# Altium schematic sheet WX0.012.461DL.SchDoc
size A2
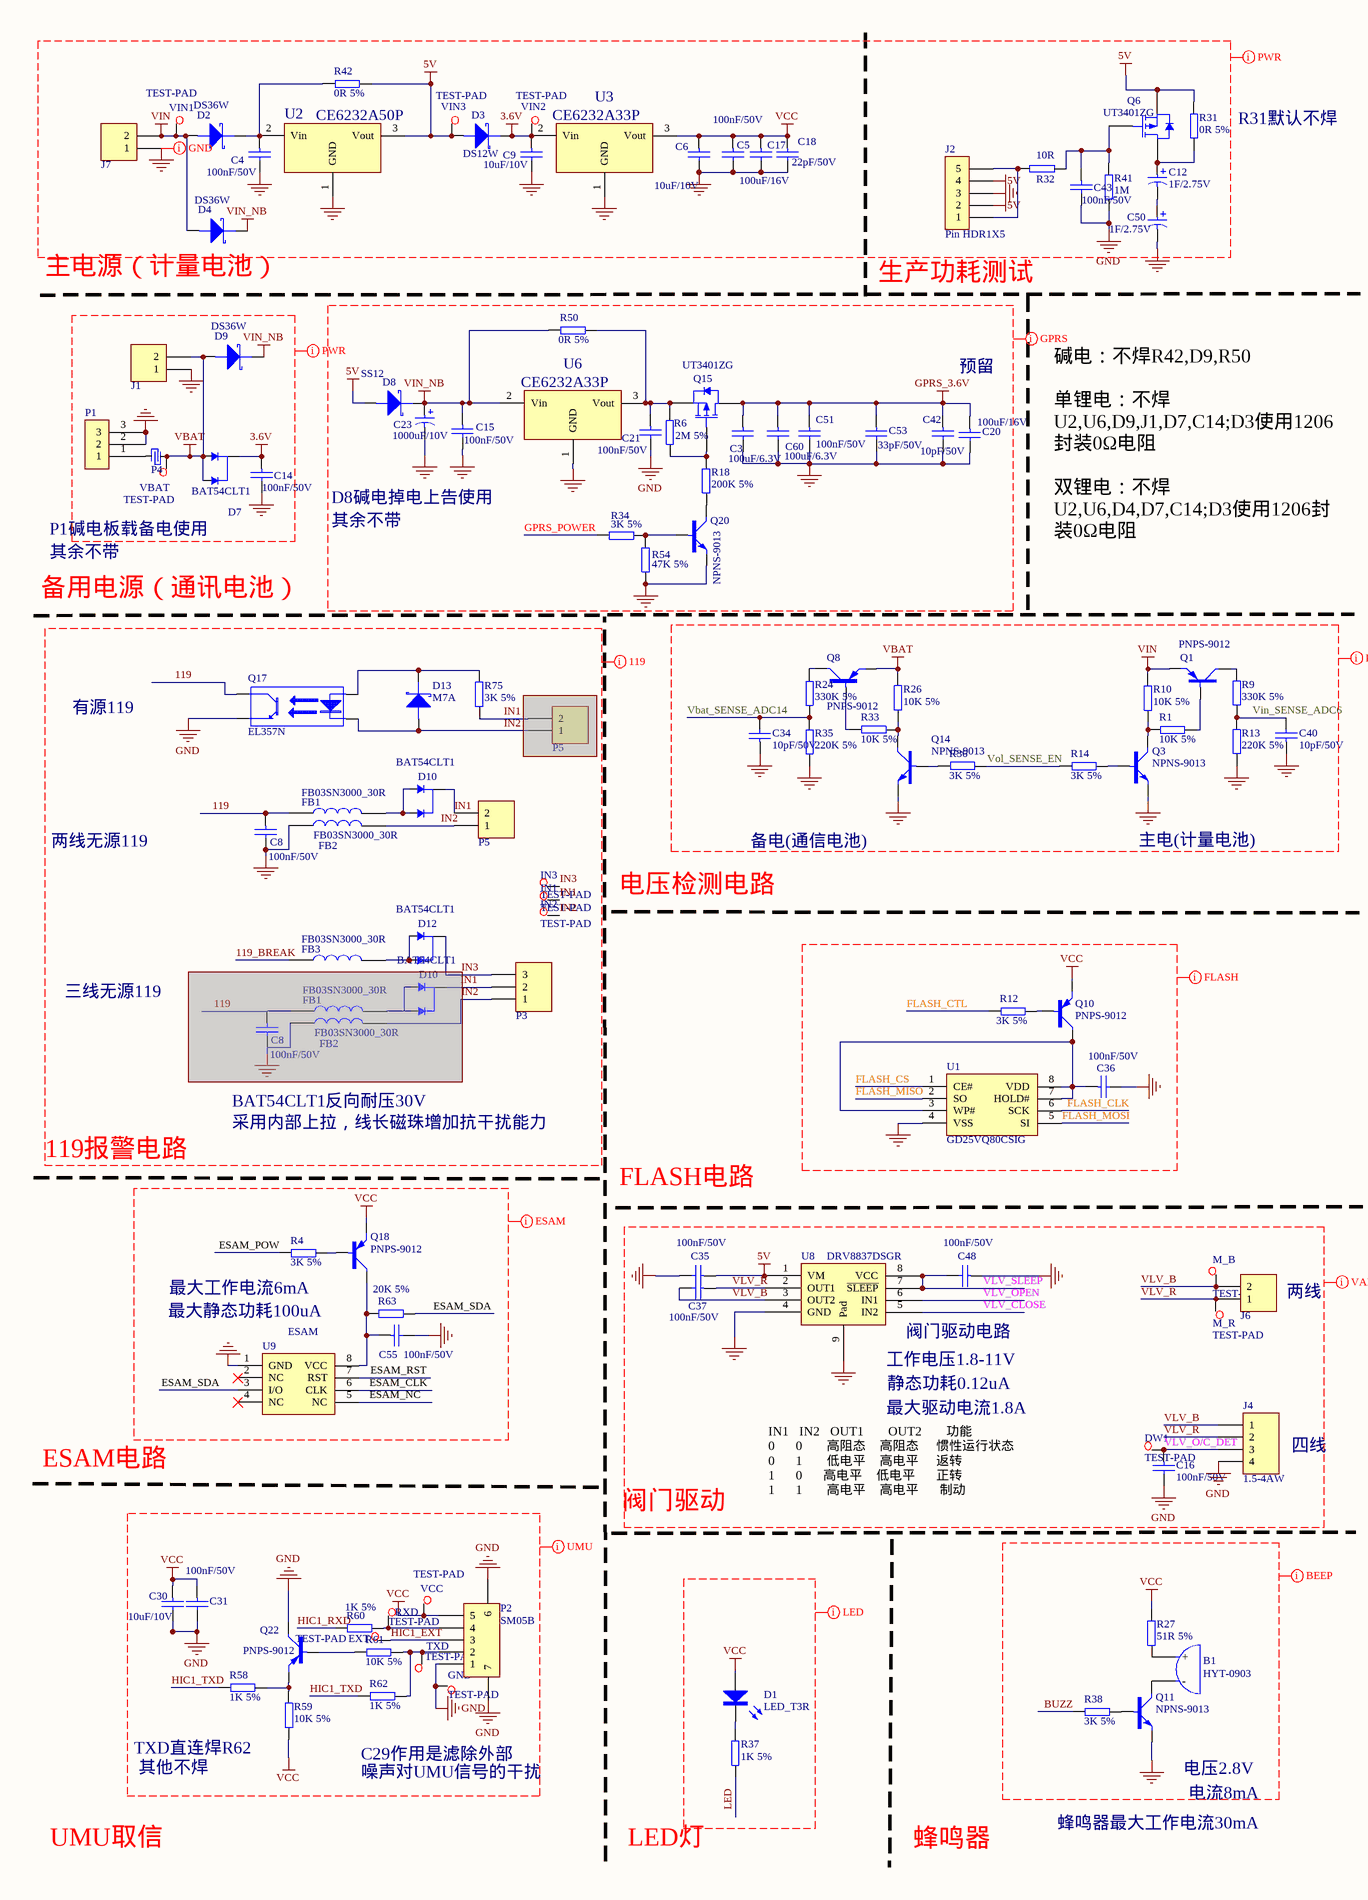
[diagram p0: WX0.012.461DL.SchDoc, left]
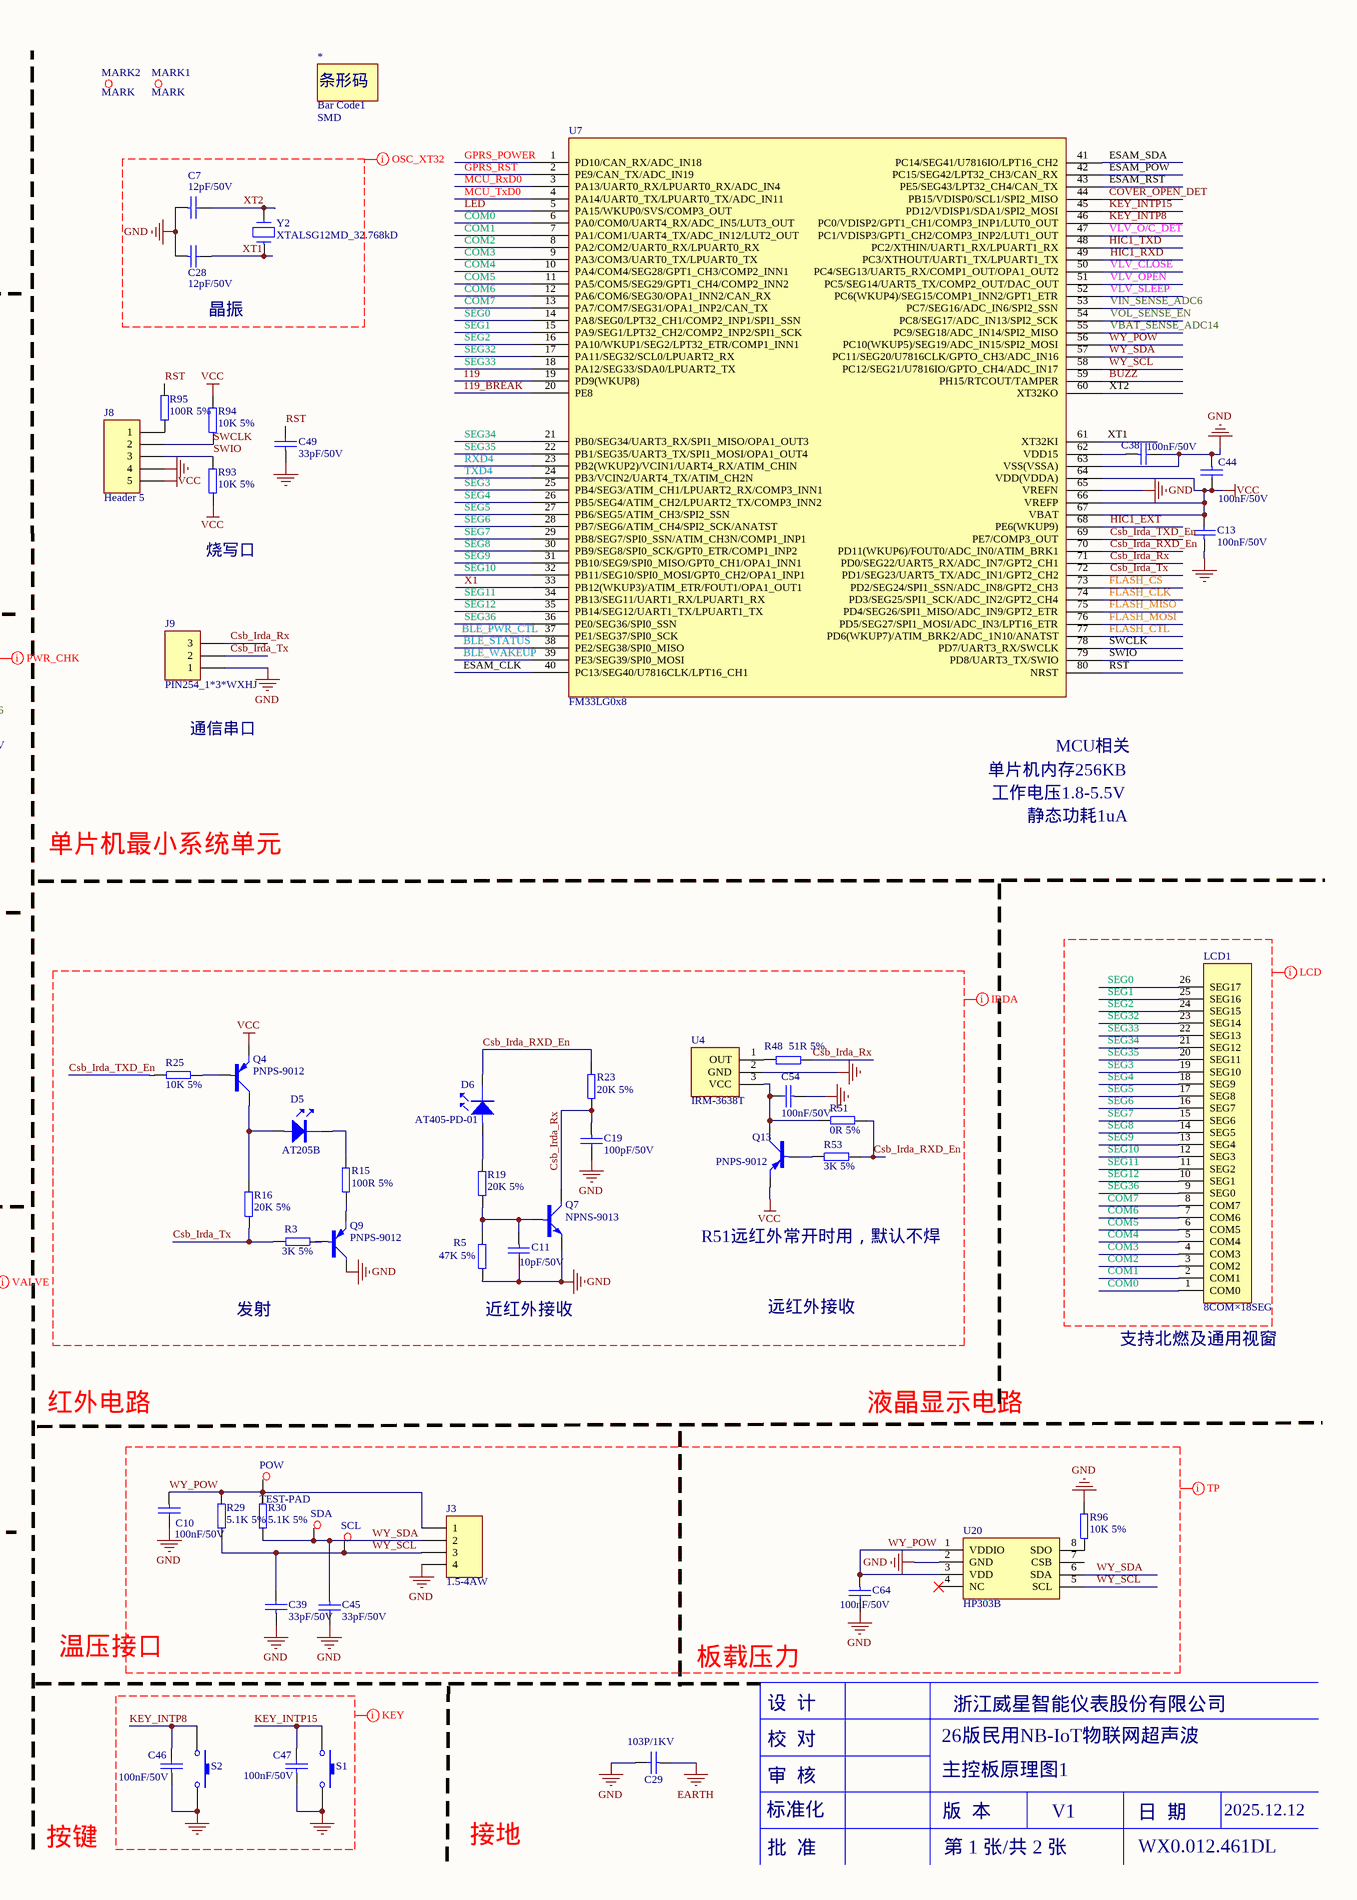
[diagram p1: WX0.012.461DL.SchDoc, right]

## Parts
(Parts that share a designator on the sheet are numbered #1, #2 ... from top to bottom, then left to right.)
*  Bar Code1  SMD/DIP: SMD  [Bar Code1]
B1  HYT-0903  [HYT-0903]
C3  100uF/6.3V  [GRM1206]
C4  100nF/50V  [CAP0402]
C5  100nF/50V  [CAP0402]
C6  10uF/10V  [CAP0402]
C7  12pF/50V  [CAP0402]
C8#1  100nF/50V  [CAP0402]
C8#2  100nF/50V  [CAP0402]  (masked out: inside a compile mask, not in the netlist)
C9  10uF/10V  [CAP0402]
C10  100nF/50V  [CAP0402]
C11  10pF/50V  [CAP0402]
C12  1F/2.75V  [CAPPC_350_800_1400]
C13  100nF/50V  [CAP0402]
C14  100nF/50V  [CAP0402]
C15  100nF/50V  [CAP0402]
C16  100nF/50V  [CAP0402]
C17  100uF/16V  [GRM31CR60J107ME39L]
C18  22pF/50V  [CAP0402]
C19  100pF/50V  [CAP0402]
C20  100uF/16V  [GRM31CR60J107ME39L]
C21  100nF/50V  [CAP0402]
C23  1000uF/10V  [CAPPC_350_800_1200]
C28  12pF/50V  [CAP0402]
C29  103P/1KV  [CAP1206]
C30  10uF/10V  [CAP0402]
C31  100nF/50V  [CAP0402]
C34  10pF/50V  [CAP0402]
C35  100nF/50V  [CAP0402]
C36  100nF/50V  [CAP0402]
C37  100nF/50V  [CAP0402]
C38  100nF/50V  [CAP0402]
C39  33pF/50V  [CAP0402]
C40  10pF/50V  [CAP0402]
C42  10pF/50V  [CAP0402]
C43  100nF/50V  [CAP0402]
C44  100nF/50V  [CAP0402]
C45  33pF/50V  [CAP0402]
C46  100nF/50V  [CAP0402]
C47  100nF/50V  [CAP0402]
C48  100nF/50V  [CAP0402]
C49  33pF/50V  [CAP0402]
C50  1F/2.75V  [CAPPC_350_800_1400]
C51  100nF/50V  [CAP0402]
C53  33pF/50V  [CAP0402]
C54  100nF/50V  [CAP0402]
C55  100nF/50V  [CAP0402]
C60  100uF/6.3V  [GRM1206]
C64  100nF/50V  [CAP0402]
D1  LED_T3R  [IR_254_1000_500]
D2  DS36W  [SOD-123FL]
D3  DS12W  [SOD-123FL]
D4  DS36W  [SOD-123FL]
D5  AT205B  [IR_254_1000_500]
D6  AT405-PD-01  [IR_254_1000_500]
D7  BAT54CLT1  [SOT-23]
D8  SS12  [DO-214AC]
D9  DS36W  [SOD-123FL]
D10#1  BAT54CLT1  [SOT-23]
D10#2  BAT54CLT1  [SOT-23]  (masked out: inside a compile mask, not in the netlist)
D12  BAT54CLT1  [SOT-23]
D13  M7A  [DO-214AC]
DW1  TEST-PAD  [TEST-PAD]
EXT  TEST-PAD  [TEST-PAD]
FB1#1  FB03SN3000_30R  [IND0603]
FB1#2  FB03SN3000_30R  [IND0603]  (masked out: inside a compile mask, not in the netlist)
FB2#1  FB03SN3000_30R  [IND0603]
FB2#2  FB03SN3000_30R  [IND0603]  (masked out: inside a compile mask, not in the netlist)
FB3  FB03SN3000_30R  [IND0603]
GND  TEST-PAD  [TEST-PAD]
IN1  TEST-PAD  [TEST-PAD]
IN2  TEST-PAD  [TEST-PAD]
IN3  TEST-PAD  [TEST-PAD]
J1  PH200_1*2R  [PH200_1*2R]  (value not drawn)
J2  Pin HDR1X5  [PIN254_1*5SR]
J3  1.5-4AW  [1.5-4AW]
J4  1.5-4AW  [CONN-TH_530480410]
J6  PH200_1*2R  [PH200_1*2R]  (value not drawn)
J7  PH200_1*2R  [PH200_1*2R]  (value not drawn)
J8  Header 5  [PIN254_1*5SR]
J9  PIN254_1*3*WXHJ  [PIN254_1*3*WXHJ]
LCD1  8COM×18SEG  [LCD]
M_B  TEST-PAD  [TEST-PAD]
M_R  TEST-PAD  [TEST-PAD]
MARK1  MARK  [MARK]
MARK2  MARK  [MARK]
P1  Component_2  [板载锂电池]  (value not drawn)
P2  SM05B  [SMT-1.25-5]
P3  PH200_1*3R  [PH200_1*3R]  (value not drawn)
P4  Shortcircuit_Pad  [短路点]  (value not drawn)
P5#1  PH200_1*2R  [PH200_1*2R]  (value not drawn)  (masked out: inside a compile mask, not in the netlist)
P5#2  PH200_1*2R  [PH200_1*2R]  (value not drawn)
POW  TEST-PAD  [TEST-PAD]
Q1  PNPS-9012  [SOT-323-3_L2.0-W1.3-P1.30-LS2.1-BR]
Q3  NPNS-9013  [SOT-323-3_L2.0-W1.3-P1.30-LS2.1-BR]
Q4  PNPS-9012  [SOT-323-3_L2.0-W1.3-P1.30-LS2.1-BR]
Q6  UT3401ZG  [SOT-23]
Q7  NPNS-9013  [SOT-323-3_L2.0-W1.3-P1.30-LS2.1-BR]
Q8  PNPS-9012  [SOT-323-3_L2.0-W1.3-P1.30-LS2.1-BR]
Q9  PNPS-9012  [SOT-323-3_L2.0-W1.3-P1.30-LS2.1-BR]
Q10  PNPS-9012  [SOT-323-3_L2.0-W1.3-P1.30-LS2.1-BR]
Q11  NPNS-9013  [SOT-323-3_L2.0-W1.3-P1.30-LS2.1-BR]
Q13  PNPS-9012  [SOT-323-3_L2.0-W1.3-P1.30-LS2.1-BR]
Q14  NPNS-9013  [SOT-323-3_L2.0-W1.3-P1.30-LS2.1-BR]
Q15  UT3401ZG  [SOT-23]
Q17  EL357N  [EL357D]
Q18  PNPS-9012  [SOT-323-3_L2.0-W1.3-P1.30-LS2.1-BR]
Q20  NPNS-9013  [SOT-323-3_L2.0-W1.3-P1.30-LS2.1-BR]
Q22  PNPS-9012  [SOT-323-3_L2.0-W1.3-P1.30-LS2.1-BR]
R1  10K 5%  [RES0402]
R3  3K 5%  [RES0402]
R4  3K 5%  [RES0402]
R5  47K 5%  [RES0402]
R6  2M 5%  [RES0402]
R9  330K 5%  [RES0402]
R10  10K 5%  [RES0402]
R12  3K 5%  [RES0402]
R13  220K 5%  [RES0402]
R14  3K 5%  [RES0402]
R15  100R 5%  [RES0402]
R16  20K 5%  [RES0402]
R18  200K 5%  [RES0402]
R19  20K 5%  [RES0402]
R23  20K 5%  [RES0402]
R24  330K 5%  [RES0402]
R25  10K 5%  [RES0402]
R26  10K 5%  [RES0402]
R27  51R 5%  [RES0402]
R29  5.1K 5%  [RES0402]
R30  5.1K 5%  [RES0402]
R31  0R 5%  [RES1206]
R32  10R  [RES0402]
R33  10K 5%  [RES0402]
R34  3K 5%  [RES0402]
R35  220K 5%  [RES0402]
R36  3K 5%  [RES0402]
R37  1K 5%  [RES0402]
R38  3K 5%  [RES0402]
R41  1M  [RES0402]
R42  0R 5%  [RES1206]
R48  51R 5%  [RES0402]
R50  0R 5%  [RES1206]
R51  0R 5%  [RES0402]
R53  3K 5%  [RES0402]
R54  47K 5%  [RES0402]
R58  1K 5%  [RES0402]
R59  10K 5%  [RES0402]
R60  1K 5%  [RES0402]
R61  10K 5%  [RES0402]
R62  1K 5%  [RES0402]
R63  20K 5%  [RES0402]
R75  3K 5%  [RES0402]
R93  10K 5%  [RES0402]
R94  10K 5%  [RES0402]
R95  100R 5%  [RES0402]
R96  10K 5%  [RES0402]
RXD  TEST-PAD  [TEST-PAD]
S1  SWT_4_600_600_430  [SWT_4_600_600]  (value not drawn)
S2  SWT_4_600_600_430  [SWT_4_600_600]  (value not drawn)
SCL  TEST-PAD  [TEST-PAD]  (value not drawn)
SDA  TEST-PAD  [TEST-PAD]  (value not drawn)
TXD  TEST-PAD  [TEST-PAD]
U1  GD25VQ80CSIG  [USON8-EP(2x3)]
U2  CE6232A50P  [SOT-89]
U3  CE6232A33P  [SOT-89]
U4  IRM-3638T  [接收头]
U6  CE6232A33P  [SOT-89]
U7  FM33LG0x8  [LQFP80]
U8  DRV8837DSGR  [S-PWSON-N8]
U9  ESAM  [SOP-8L-200MIL/SOP-8]
U20  HP303B  [LGA_8]
VBAT  TEST-PAD  [TEST-PAD]
VCC  TEST-PAD  [TEST-PAD]
VIN1  TEST-PAD  [TEST-PAD]
VIN2  TEST-PAD  [TEST-PAD]
VIN3  TEST-PAD  [TEST-PAD]
Y2  XTALSG12MD_32.768kD  [SMD-3215_2P]

## Nets
3.6V: C9.1 C14.1 D3.2 D7.3(C) U3.2(Vin) VIN2.1
5V: C35.1 D3.1 D8.1 J2.2 J2.4 Q6.2(S) R31.1 R42.2 U2.3(Vout) U8.1(VM) VIN3.1
EARTH: C29.1
GND: C3.2 C4.2 C5.2 C6.2 C7.1 C8#1.2 C9.2 C10.2 C11.2 C13.1 C14.2 C15.2 C16.2 C17.2 C18.2 C19.2 C20.2 C21.2 C23.2 C28.1 C29.2 C30.2 C31.2 C34.1 C35.2 C36.2 C38.2 C39.1 C40.1 C42.2 C43.2 C44.1 C45.2 C46.1 C47.1 C48.1 C49.1 C50.2 C51.2 C53.2 C54.1 C55.2 C60.2 C64.2 FB2#1.1 GND.1 J1.1 J2.3 J3.4 J4.4 J7.1 J8.4 J9.1 P1.2 P1.3 P2.1 P2.6 P2.7 Q3.2(E) Q7.2(E) Q9.3(C) Q11.2(E) Q14.2(E) Q17.3 Q20.2(E) Q22.3(C) R5.1 R13.2 R35.2 R41.2 R54.1 R96.2 S1.2 S2.2 U1.4(VSS) U2.1(GND) U3.1(GND) U4.2(GND) U6.1(GND) U7.63(VSS(VSSA)) U7.65(VREFN) U8.4(GND) U8.9(Pad) U9.1(GND) U20.2(GND)
GPRS_3.6V: C3.1 C20.1 C42.1 C51.1 C53.1 C60.1 Q15.3(D)
VBAT: D7.1(A) D7.2(A) D9.1 J1.2 P4.1 Q8.2(E) R26.2 VBAT.1
VCC: C5.1 C6.1 C13.2 C17.1 C18.1 C30.1 C31.1 C44.2 D1.1 J8.5 P2.5 Q4.2(E) Q10.2(E) Q13.2(E) Q18.2(E) R27.2 R59.2 R93.1 R94.2 U3.3(Vout) U7.64(VDD(VDDA)) U7.66(VREFP) U7.67(VBAT) VCC.1
VIN: D2.1 D4.1 J7.2 Q1.2(E) R10.2 VIN1.1
VIN_NB: C15.1 C23.1 D4.2 D8.2 D9.2 R50.1 U6.2(Vin)
119: C8#1.1 FB1#1.1 Q17.4 U7.19(PD9(WKUP8))
119_BREAK: FB3.1 U7.20(PE8)
BLE_PWR_CTL: U7.37(PE1/SEG37/SPI0_SCK)
BLE_STATUS: U7.38(PE2/SEG38/SPI0_MISO)
BLE_WAKEUP: U7.39(PE3/SEG39/SPI0_MOSI)
BUZZ: R38.1 U7.59(PH15/RTCOUT/TAMPER)
COM0: LCD1.1(COM0) U7.6(PA0/COM0/UART4_RX/ADC_IN5/LUT3_OUT)
COM1: LCD1.2(COM1) U7.7(PA1/COM1/UART4_TX/ADC_IN12/LUT2_OUT)
COM2: LCD1.3(COM2) U7.8(PA2/COM2/UART0_RX/LPUART0_RX)
COM3: LCD1.4(COM3) U7.9(PA3/COM3/UART0_TX/LPUART0_TX)
COM4: LCD1.5(COM4) U7.10(PA4/COM4/SEG28/GPT1_CH3/COMP2_INN1)
COM5: LCD1.6(COM5) U7.11(PA5/COM5/SEG29/GPT1_CH4/COMP2_INN2)
COM6: LCD1.7(COM6) U7.12(PA6/COM6/SEG30/OPA1_INN2/CAN_RX)
COM7: LCD1.8(COM7) U7.13(PA7/COM7/SEG31/OPA1_INP2/CAN_TX)
COVER_OPEN_DET: U7.44(PB15/VDISP0/SCL1/SPI2_MISO)
Csb_Irda_Rx: C19.1 J9.3 Q7.3(C) R23.1 R48.2 U7.71(PD0/SEG22/UART5_RX/ADC_IN7/GPT2_CH1)
Csb_Irda_RXD_En: D6.2 R23.2 R51.1 R53.1 U7.70(PD11(WKUP6)/FOUT0/ADC_IN0/ATIM_BRK1)
Csb_Irda_Tx: J9.2 R3.1 R16.1 U7.72(PD1/SEG23/UART5_TX/ADC_IN1/GPT2_CH2)
Csb_Irda_TXD_En: R25.2 U7.69(PE7/COMP3_OUT)
ESAM_CLK: U7.40(PC13/SEG40/U7816CLK/LPT16_CH1) U9.6(CLK)
ESAM_NC: U9.5(NC)
ESAM_POW: R4.1 U7.42(PC15/SEG42/LPT32_CH3/CAN_RX)
ESAM_RST: U7.43(PE5/SEG43/LPT32_CH4/CAN_TX) U9.7(RST)
ESAM_SDA: R63.2 U7.41(PC14/SEG41/U7816IO/LPT16_CH2) U9.3(I/O)
FLASH_CLK: U1.6(SCK) U7.74(PD3/SEG25/SPI1_SCK/ADC_IN2/GPT2_CH4)
FLASH_CS: U1.1(CE#) U7.73(PD2/SEG24/SPI1_SSN/ADC_IN8/GPT2_CH3)
FLASH_CTL: R12.1 U7.77(PD6(WKUP7)/ATIM_BRK2/ADC_1N10/ANATST)
FLASH_MISO: U1.2(SO) U7.75(PD4/SEG26/SPI1_MISO/ADC_IN9/GPT2_ETR)
FLASH_MOSI: U1.5(SI) U7.76(PD5/SEG27/SPI1_MOSI/ADC_IN3/LPT16_ETR)
GPRS_POWER: R34.1 U7.1(PD10/CAN_RX/ADC_IN18)
GPRS_RST: U7.2(PE9/CAN_TX/ADC_IN19)
HIC1_EXT: EXT.1 P2.3 U7.68(PE6(WKUP9))
HIC1_RXD: R60.1 U7.49(PC3/XTHOUT/UART1_TX/LPUART1_TX)
HIC1_TXD: R58.1 R62.1 U7.48(PC2/XTHIN/UART1_RX/LPUART1_RX)
IN1: D10#1.3(C) IN1.1 P5#2.2 R75.1
IN2: D13.1 FB2#1.2 IN2.1 P5#2.1 Q17.2
IN3: IN3.1
KEY_INTP8: C46.2 S2.1 U7.46(PC0/VDISP2/GPT1_CH1/COMP3_INP1/LUT0_OUT)
KEY_INTP15: C47.2 S1.1 U7.45(PD12/VDISP1/SDA1/SPI2_MOSI)
LED: R37.1 U7.5(PA15/WKUP0/SVS/COMP3_OUT)
MCU_RxD0: U7.3(PA13/UART0_RX/LPUART0_RX/ADC_IN4)
MCU_TxD0: U7.4(PA14/UART0_TX/LPUART0_TX/ADC_IN11)
RST: C49.2 R95.1 U7.80(NRST)
RXD4: U7.23(PB2(WKUP2)/VCIN1/UART4_RX/ATIM_CHIN)
SEG0: LCD1.26(SEG17) U7.14(PA8/SEG0/LPT32_CH1/COMP2_INP1/SPI1_SSN)
SEG1: LCD1.25(SEG16) U7.15(PA9/SEG1/LPT32_CH2/COMP2_INP2/SPI1_SCK)
SEG2: LCD1.24(SEG15) U7.16(PA10/WKUP1/SEG2/LPT32_ETR/COMP1_INN1)
SEG3: LCD1.19(SEG10) U7.25(PB4/SEG3/ATIM_CH1/LPUART2_RX/COMP3_INN1)
SEG4: LCD1.18(SEG9) U7.26(PB5/SEG4/ATIM_CH2/LPUART2_TX/COMP3_INN2)
SEG5: LCD1.17(SEG8) U7.27(PB6/SEG5/ATIM_CH3/SPI2_SSN)
SEG6: LCD1.16(SEG7) U7.28(PB7/SEG6/ATIM_CH4/SPI2_SCK/ANATST)
SEG7: LCD1.15(SEG6) U7.29(PB8/SEG7/SPI0_SSN/ATIM_CH3N/COMP1_INP1)
SEG8: LCD1.14(SEG5) U7.30(PB9/SEG8/SPI0_SCK/GPT0_ETR/COMP1_INP2)
SEG9: LCD1.13(SEG4) U7.31(PB10/SEG9/SPI0_MISO/GPT0_CH1/OPA1_INN1)
SEG10: LCD1.12(SEG3) U7.32(PB11/SEG10/SPI0_MOSI/GPT0_CH2/OPA1_INP1)
SEG11: LCD1.11(SEG2) U7.34(PB13/SEG11/UART1_RX/LPUART1_RX)
SEG12: LCD1.10(SEG1) U7.35(PB14/SEG12/UART1_TX/LPUART1_TX)
SEG32: LCD1.23(SEG14) U7.17(PA11/SEG32/SCL0/LPUART2_RX)
SEG33: LCD1.22(SEG13) U7.18(PA12/SEG33/SDA0/LPUART2_TX)
SEG34: LCD1.21(SEG12) U7.21(PB0/SEG34/UART3_RX/SPI1_MISO/OPA1_OUT3)
SEG35: LCD1.20(SEG11) U7.22(PB1/SEG35/UART3_TX/SPI1_MOSI/OPA1_OUT4)
SEG36: LCD1.9(SEG0) U7.36(PE0/SEG36/SPI0_SSN)
SWCLK: J8.2 R94.1 U7.78(PD7/UART3_RX/SWCLK)
SWIO: J8.3 R93.2 U7.79(PD8/UART3_TX/SWIO)
TXD4: U7.24(PB3/VCIN2/UART4_TX/ATIM_CH2N)
Vbat_SENSE_ADC14: C34.2 R24.2 R35.1 U7.55(PC9/SEG18/ADC_IN14/SPI2_MISO)
Vin_SENSE_ADC6: C40.2 R9.2 R13.1 U7.53(PC7/SEG16/ADC_IN6/SPI2_SSN)
VLV_B: C37.2 J4.1 J6.2 M_B.1 U8.3(OUT2)
VLV_CLOSE: U7.50(PC4/SEG13/UART5_RX/COMP1_OUT/OPA1_OUT2) U8.5(IN2)
VLV_O/C_DET: C16.1 DW1.1 J4.3 U7.47(PC1/VDISP3/GPT1_CH2/COMP3_INP2/LUT1_OUT)
VLV_OPEN: U7.51(PC5/SEG14/UART5_TX/COMP2_OUT/DAC_OUT) U8.6(IN1)
VLV_R: C37.1 J4.2 J6.1 M_R.1 U8.2(OUT1)
VLV_SLEEP: C48.2 U7.52(PC6(WKUP4)/SEG15/COMP1_INN2/GPT1_ETR) U8.7(~{SLEEP}) U8.8(VCC)
Vol_SENSE_EN: R14.1 R36.1 U7.54(PC8/SEG17/ADC_IN13/SPI2_SCK)
WY_POW: C10.1 C64.1 J3.1 POW.1 R29.1 R30.1 U7.56(PC10(WKUP5)/SEG19/ADC_IN15/SPI2_MOSI) U20.1(VDDIO) U20.3(VDD)
WY_SCL: C39.2 J3.3 R29.2 SCL.1 U7.58(PC12/SEG21/U7816IO/GPTO_CH4/ADC_IN17) U20.5(SCL)
WY_SDA: C45.1 J3.2 R30.2 SDA.1 U7.57(PC11/SEG20/U7816CLK/GPTO_CH3/ADC_IN16) U20.6(SDA)
X1: U7.33(PB12(WKUP3)/ATIM_ETR/FOUT1/OPA1_OUT1)
XT1: C28.2 U7.61(XT32KI) Y2.1
XT2: C7.2 U7.60(XT32KO) Y2.2
NetB1_1: B1.1(+) R27.1
NetB1_2: B1.2(-) Q11.3(C)
NetC4_1: C4.1 D2.2 R42.1 U2.2(Vin)
NetC11_1: C11.1 Q7.1(B) R5.2 R19.1
NetC12_1: C12.1 Q6.3(D) R31.2
NetC12_2: C12.2 C50.1
NetC21_1: C21.1 Q15.2(S) R6.2 R50.2 U6.3(Vout)
NetC36_1: C36.1 Q10.3(C) U1.3(WP#) U1.7(HOLD#) U1.8(VDD)
NetC38_1: C38.1 U7.62(VDD15)
NetC43_1: C43.1 Q6.1(G) R32.1 R41.1
NetC54_2: C54.2 Q13.3(C) R51.2 U4.3(VCC)
NetC55_1: C55.1 Q18.3(C) R63.1 U9.8(VCC)
NetD1_2: D1.2 R37.2
NetD5_1: D5.1 Q4.3(C) R16.2
NetD5_2: D5.2 R15.2
NetD6_1: D6.1 R19.2
NetD10#1_1: D10#1.1(A) D10#1.2(A) FB1#1.2
NetD12_1: D12.1(A) D12.2(A) FB3.2
NetD12_3: D12.3(C) P3.3
NetD13_2: D13.2 Q17.1 R75.2
NetJ2_1: J2.1 J2.5 R32.2
NetJ8_1: J8.1 R95.2
NetP1_1: P1.1 P4.0
NetP2_2: P2.2 R61.2 R62.2 TXD.1
NetP2_4: P2.4 R60.2 RXD.1
NetQ1_1: Q1.1(B) R1.2
NetQ1_3: Q1.3(C) R9.1
NetQ3_1: Q3.1(B) R14.2
NetQ3_3: Q3.3(C) R1.1 R10.1
NetQ4_1: Q4.1(B) R25.1
NetQ8_1: Q8.1(B) R33.2
NetQ8_3: Q8.3(C) R24.1
NetQ9_1: Q9.1(B) R3.2
NetQ9_2: Q9.2(E) R15.1
NetQ10_1: Q10.1(B) R12.2
NetQ11_1: Q11.1(B) R38.2
NetQ13_1: Q13.1(B) R53.2
NetQ14_1: Q14.1(B) R36.2
NetQ14_3: Q14.3(C) R26.1 R33.1
NetQ15_1: Q15.1(G) R6.1 R18.2
NetQ18_1: Q18.1(B) R4.2
NetQ20_1: Q20.1(B) R34.2 R54.2
NetQ20_3: Q20.3(C) R18.1
NetQ22_1: Q22.1(B) R61.1
NetQ22_2: Q22.2(E) R58.2 R59.1
NetR48_1: R48.1 U4.1(OUT)
NetR96_1: R96.1 U20.8(SDO)

Not connected (* = marked no-connect by the designer): P3 1 2; U9 2(NC)* 4(NC)*; U20 4(NC)* 7(CSB)

## Layout directives
net class VALVE; : PWR: 5V, GND, VLV_B, VLV_CLOSE, VLV_O/C_DET, VLV_OPEN, VLV_R, VLV_SLEEP
net class FLASH: FLASH_CLK, FLASH_CS, FLASH_CTL, FLASH_MISO, FLASH_MOSI, GND, VCC
net class KEY: GND, KEY_INTP8, KEY_INTP15
net class TP: GND, WY_POW, WY_SCL, WY_SDA
net class LCD: COM0, COM1, COM2, COM3, COM4, COM5, COM6, COM7, SEG0, SEG1, SEG2, SEG3, SEG4, SEG5, SEG6, SEG7, SEG8, SEG9, SEG10, SEG11, SEG12, SEG32, SEG33, SEG34, SEG35, SEG36
net class IRDA: Csb_Irda_Rx, Csb_Irda_RXD_En, Csb_Irda_Tx, Csb_Irda_TXD_En, GND, VCC
net class BEEP: BUZZ, GND, VCC
net class LED: LED, VCC
net class UMU: GND, HIC1_EXT, HIC1_RXD, HIC1_TXD, VCC
net class ESAM: ESAM_CLK, ESAM_NC, ESAM_POW, ESAM_RST, ESAM_SDA, GND, VCC
net class 119: 119, 119_BREAK, GND, IN1, IN2, IN3
net class PWR_CHK: GND, VBAT, Vbat_SENSE_ADC14, VIN, Vin_SENSE_ADC6, Vol_SENSE_EN
net class OSC_XT32: GND, XT1, XT2
net class PWR: 3.6V, 5V, GND, VBAT, VCC, VIN, VIN_NB
net class GND: GND
net class GPRS: 5V, GND, GPRS_3.6V, GPRS_POWER, VIN_NB

## Notes on the sheet
- (near R31) R31默认不焊
- (near D4) 主电源（计量电池）
- (near J2) 生产功耗测试
- 晶振
- 预留
- D8碱电掉电上告使用
- 其余不带
- P1碱电板载备电使用
- 碱电：不焊R42,D9,R50
  单锂电：不焊U2,U6,D9,J1,D7,C14;D3使用1206封装0Ω电阻
  双锂电：不焊U2,U6,D4,D7,C14;D3使用1206封装0Ω电阻
- 烧写口
- 备用电源（通讯电池）
- 有源119
- 通信串口
- 单片机内存256KB
- MCU相关
- 工作电压1.8-5.5V
- 静态功耗1uA
- 两线无源119
- 电压检测电路
- 备电(通信电池)
- (near Q3) 主电(计量电池)
- 单片机最小系统单元
- 三线无源119
- 采用内部上拉，线长磁珠增加抗干扰能力
- BAT54CLT1反向耐压30V
- 119报警电路
- FLASH电路
- R51远红外常开时用，默认不焊
- 最大静态功耗100uA
- 最大工作电流6mA
- 两线
- 发射
- 近红外接收
- 远红外接收
- (near U8) 工作电压1.8-11V
- (near U8) 阀门驱动电路
- 液晶显示电路
- (near LCD1) 支持北燃及通用视窗
- 最大驱动电流1.8A
- 静态功耗0.12uA
- 红外电路
- ESAM电路
- IN1   IN2   OUT1       OUT2       功能
  0      0       高阻态    高阻态     惯性运行状态
  0      1       低电平    高电平     返转
  1      0      高电平    低电平      正转
  1      1       高电平    高电平      制动
- 四线
- 阀门驱动
- 温压接口
- 板载压力
- 设  计
- 26版民用NB-IoT物联网超声波
- 浙江威星智能仪表股份有限公司
- TXD直连焊R62
- 其他不焊
- C29作用是滤除外部
- 噪声对UMU信号的干扰
- (near Q11) 电压2.8V
- 电流8mA
- 审  核
- 校  对
- 主控板原理图1
- UMU取信
- LED灯
- 蜂鸣器
- 蜂鸣器最大工作电流30mA
- 按键
- 接地
- 标准化
- 批  准
- 版  本
- 第 1 张/共 2 张
- V1
- 日  期
- WX0.012.461DL
- 2025.12.12

## Library data of the parts
* = AD_WXHJ_Bar Code_02: 条形码 ,填充，无需焊接器件; ID: 17; Part Number: AD_WXHJ_Bar Code_02; Part Name: 条形码
B1 = 1010602-0007: 直插,直径9mm,高5.5mm,5 V,2 V,30 mA,兴化市华宇电子有限公司,HYT-0903; Part Name: 有源蜂鸣器; ID: 28; SMD/DIP: DIP; Part Number: 1010602-0007
C3 C60 = 101020101-0020: 100uF,6.3 V,±20%,1206,村田,GRM31CR60J107ME39L; Part Name: 1206贴片电容; ID: 27; SMD/DIP: SMD; Part Number: 101020101-0020
C4 C5 C8#1 C8#2 C10 C13-C16 C21 C31 C35-C38 C43 C44 C46-C48 C51 C54 C55 C64 = 101020103-0021: 104pF,50 V,±10%,0603,国巨,CC0603KRX7R9BB104; Part Name: 0603贴片电容; ID: 3; SMD/DIP: SMD; Part Number: 101020103-0021
C6 C9 C30 = 101020103-0026: 106pF,10 V,±10%,0603,村田,GRM188R61A106KE47D; Part Name: 0603贴片电容; ID: 8; SMD/DIP: SMD; Part Number: 101020103-0026
C7 C28 = 101020103-0005: 12P,50 V,±5%,0603,国巨,CC0603JRNPO9BN12; Part Name: 0603贴片电容; ID: 11; SMD/DIP: SMD; Part Number: 101020103-0005
C11 C34 C40 C42 = 101020103-0014: 10pF,50 V,±5%,0603,X7R,国巨,CC0603JRNPO9BN100; Part Name: 0603贴片电容; ID: 7; SMD/DIP: SMD; Part Number: 101020103-0014
C12 C50 = 1010202-0015: 1F,2.75 V,-20%~+20%,8mm*16mm,红宝石,2.7 DMC 1 M MY4 8X16; Part Name: 法拉电容; ID: 12; SMD/DIP: DIP; Part Number: 1010202-0015
C17 = 101020101-0005: 100u,16 V,±10%,1206,国巨,CC1206KRNPO7BN106P; Part Name: 1206贴片电容; ID: 9; SMD/DIP: SMD
C18 = 101020103-0009: 22pF,50 V,±5%,0603,国巨,CC0603JRNPO9BN22; Part Name: 0603贴片电容; ID: 16; SMD/DIP: SMD; Part Number: 101020103-0009
C19 = 101020103-0010: 101pf,50 V,±5%,0603,国巨,CC0603JRNP09BN101; Part Name: 0603贴片电容; ID: 4; SMD/DIP: SMD; Part Number: 101020103-0010
C20 = 101020101-0005: Part Name: 1206贴片电容; ID: 9; SMD/DIP: SMD
C23 = 1010203-0029: 1000uF,16 V,±20%,8*20mm,Rubycon,16ZLH1000M; Part Name: 电解电容; ID: 2; SMD/DIP: DIP; Part Number: 1010203-0029
C29 = 101020103-0021: 103P/1KV,±10％,1206; Part Number: 101020101-0003; Part Name: 1206贴片电容; ID: 3; SMD/DIP: SMD
C39 C45 C49 = 101020103-0027: 33pF,50 V,±10%,0603,国巨,CC0603KRNPO9BN33; Part Name: 0603贴片电容; ID: 17; SMD/DIP: SMD; Part Number: 101020103-0027
C53 = 101020103-0027: 33pF,50 V,±10%,0603,国巨,CC0603KRNPO9BN33; Part Name: 0603贴片电容; ID: 18; SMD/DIP: SMD; Part Number: 101020103-0027
D1 = 101040102-0001: 圆形插件,3mm 圆形,插件,红光,湖北匡通电子有限公司,3BB4HC; Part Name: 发光二极管; ID: 6; SMD/DIP: DIP; Part Number: 101040102-0001
D2 D4 D9 = 101040101-0048: DS36W,SOD123-FL,3 A,42 V,60 V,浙江领晨科技有限公司,DS36W; Part Number: 101040101-0055; Part Name: 贴片肖特基; ID: 8; SMD/DIP: SMD
D3 = 101040101-0048: DS12W,SOD-123FL,1 A,0.55 V,20 V,领晨科技,DS12W; Part Name: 贴片肖特基; ID: 9; SMD/DIP: SMD; Part Number: 101040101-0048
D5 = 101040101-0034: 直插,Φ5.8mm圆头透明色，,0.1 A,4 V,5 V,上海品观电子有限公司,AT205B; Part Name: 红外发射管; ID: 2; SMD/DIP: DIP; Part Number: 101040101-0034
D6 = 101040101-0035: Φ5.8mm圆头黑色，光电接收管,Φ5.8mm,0.01 A,1.2 V,60 V,上海品观电子,AT405-PD-01; Part Name: 光敏二极管; ID: 4; SMD/DIP: DIP; Part Number: 101040101-0035
D7 D10#1 D10#2 D12 = 101040101-0038: BAT54CLT1，SOT23-3,SOT23-3,0.2 A,0.8 V,30 V,安森美,BAT54CLT1; Part Name: 贴片肖特基; ID: 31; SMD/DIP: SMD; Part Number: 101040101-0038
D8 = 101040101-0009: SS12,DO-214AC,1 A,0.55 V,20 V,昶鑫,SS12; Part Name: 贴片肖特基; ID: 13; SMD/DIP: SMD; Part Number: 101040101-0009
D13 = 101040101-0008: M7A,DO-214AC,1 A,1.1 V,1000 V,杭州闽达电子有限公司,M7A; Part Name: 贴片肖特基; ID: 12; SMD/DIP: SMD; Part Number: 101040101-0008
DW1 EXT GND IN1-IN3 M_B M_R POW RXD SCL SDA TXD VBAT VCC VIN1-VIN3 = AD_WXHJ_TEST-PAD_01: 单面焊盘测试点; Part Name: 测试点; ID: 23; SMD/DIP: SMD; Part Number: AD_WXHJ_TEST-PAD_01
FB1#1 FB1#2 FB2#1 FB2#2 FB3 = 109010101-0003: chilisin(奇力新),0603,30Ω ±25% @100MHz,150 V,125 ℃,PBY160808T-300Y-N,-55 ℃,不含铅,,,圆盘,30Ω ±25% @100MHz; Part Name: 磁珠; ID: 25; SMD/DIP: SMD; Part Number: 109010101-0003
J1 J6 J7 P5#1 P5#2 = 1010902-0105: 2.0-2AW,直插弯座，2PIN，脚间距2mm，带防翘起,公头,单排,2.0-2AW;直插弯座，2PIN,脚间距2mm，带防翘起; Part Name: PH座; ID: 11; SMD/DIP: DIP; Part Number: 1010902-0105
J3 J4 = 1010902-0114: 1.5-4AW,直插弯座，4PIN，脚间距1.5mm，带防翘起,公头,单排,1.5-4AW，直插弯座，4PIN，脚间距1.5mm，带防翘起; Part Name: 直插弯座; ID: 38; SMD/DIP: DIP; Part Number: 1010902-0114
J8 = Header 5: Header, 5-Pin
J9 = AD_WXHJ_PinHeader_04: 1*3 ，Φ1.0 ，2.54mm，直脚,无需焊接器件; Part Name: 排针; ID: 17; SMD/DIP: DIP; Part Number: AD_WXHJ_PinHeader_04
LCD1 = JR
MARK1 MARK2 = AD_WXHJ_MARK_01: MARK点; ID: 8; SMD/DIP: SMD; Part Number: AD_WXHJ_MARK_01; Part Name: MARK点
P3 = 1010902-0104: 2.0-3AW,3PIN，2mm脚间距,公头,单排,2.0-3AW；3PIN，脚间距2mm直插弯座带防翘起; Part Name: PH座; ID: 12; SMD/DIP: DIP; Part Number: 1010902-0104
Q1 Q4 Q8-Q10 Q18 = 101040201-0001: 9012,PNP,SOT-23,JCET;长电,S9012; Part Name: 贴片三极管; ID: 16; SMD/DIP: SMD; Part Number: 101040201-0001
Q3 Q7 Q11 Q14 = 101040201-0002: 9013,NPN,SOT-23,长电,S9013; Part Name: 贴片三极管; ID: 14; SMD/DIP: SMD; Part Number: 101040201-0002
Q6 Q15 = 101040201-0013: UT3401ZG,P-MOS,SOT-23,UTC,UT3401ZG; Part Name: 功率MOS管; ID: 18; SMD/DIP: SMD; Part Number: 101040201-0013
Q13 Q22 = 101040201-0001: 9012,PNP,SOT-23,JCET;长电,S9012; Part Name: 贴片三极管; ID: 17; SMD/DIP: SMD; Part Number: 101040201-0001
Q17 = 1010502-0045: SOP4,贴片,ELERLIGHT,EL357N(D)(TA)-G; Part Name: 贴片光耦; ID: 1; SMD/DIP: SMD; Part Number: 1010502-0045
Q20 = 101040201-0002: 9013,NPN,SOT-23,长电,S9013; Part Name: 贴片三极管; ID: 15; SMD/DIP: SMD; Part Number: 101040201-0002
R1 R4 R10 R25 R26 R33 R59 R61 R93 R94 = 101010103-0003: 国巨,±5%,0603,,155 ℃,-55 ℃,RC0603JR-0710KL,无铅,200 ppm/℃,1/10W,,10K; Part Name: 0603贴片电阻; ID: 7; SMD/DIP: SMD; Part Number: 101010103-0003
R3 R12 R38 R53 = 101010103-0006: 国巨,±5%,0603,,155 ℃,-55 ℃,RC0603JR-073KL,无铅,100 ppm/℃,1/10W,,3K; Part Name: 0603贴片电阻; ID: 22; SMD/DIP: SMD; Part Number: 101010103-0006
R5 R54 = 101010103-0012: 47K,±5%,1/10W,0603,国巨,RC0603JR-0747KL; Part Name: 0603贴片电阻; ID: 25; SMD/DIP: SMD; Part Number: 101010103-0012
R6 = 101010103-0025: 国巨,±5%,0603,,155 ℃,-55 ℃,RC0603JR-072ML,含铅,100 ppm/℃,1/10W,,2M; Part Name: 0603贴片电阻; ID: 20; SMD/DIP: SMD; Part Number: 101010103-0025
R9 R24 = 101010103-0066: 330K,±5%,1/10W,0603,国巨,RC0603JR-07330KL; Part Name: 0603贴片电阻; ID: 30; SMD/DIP: SMD; Part Number: 101010103-0066
R13 R35 = 101010103-0044: 220K,±5%,1/10W,0603,国巨,RC0603JR-07220KL; Part Name: 0603贴片电阻; ID: 31; SMD/DIP: SMD; Part Number: 101010103-0044
R14 R34 R36 R75 = 101010103-0006: 国巨,±5%,0603,,155 ℃,-55 ℃,RC0603JR-073KL,无铅,100 ppm/℃,1/10W,,3K; Part Name: 0603贴片电阻; ID: 23; SMD/DIP: SMD; Part Number: 101010103-0006
R15 R95 = 101010103-0022: 100R,±5%,1/10W,0603,国巨,RC0603JR-07100RL; Part Name: 0603贴片电阻; ID: 5; SMD/DIP: SMD; Part Number: 101010103-0022
R16 R19 R23 R63 = 101010103-0004: 国巨,±5%,0603,,155 ℃,-55 ℃,RC0603JR-0720KL,无铅,200 ppm/℃,1/10W,,20K; Part Name: 0603贴片电阻; ID: 15; SMD/DIP: SMD; Part Number: 101010103-0004
R18 = 101010103-0034: 200K,±5%,1/10W,0603,国巨,RC0603JR-07200KL; Part Name: 0603贴片电阻; ID: 13; SMD/DIP: SMD; Part Number: 101010103-0034
R27 = 101010103-0037: 国巨,±5%,0603,,155 ℃,-55 ℃,RC0603JR-0751RL,无铅,100 ppm/℃,1/10W,,51欧; Part Name: 0603贴片电阻; ID: 28; SMD/DIP: SMD; Part Number: 101010103-0037
R29 R30 = 101010103-0015: 国巨,±5%,0603,,155 ℃,55 ℃,RC0603JR-075.1KL,无铅,200 ppm/℃,1/10W,,5.1k; Part Name: 0603贴片电阻; ID: 26; SMD/DIP: SMD; Part Number: 101010103-0015
R31 R42 R50 = 101010101-0013: 0Ω,±5%,1/4W,1206,国巨,RC1206JR-070RL; Part Name: 1206贴片电阻; ID: 2; SMD/DIP: SMD; Part Number: 101010101-0013
R32 R41 = RES
R37 = 101010103-0008: 1K,±5%,1/10W,0603,国巨,RC0603JR-071KL; Part Name: 0603贴片电阻; ID: 9; SMD/DIP: SMD; Part Number: 101010103-0008
R48 = 101010103-0037: 国巨,±5%,0603,,155 ℃,-55 ℃,RC0603JR-0751RL,无铅,100 ppm/℃,1/10W,,51欧; Part Name: 0603贴片电阻; ID: 29; SMD/DIP: SMD; Part Number: 101010103-0037
R51 = 101010103-0001: 国巨,±5%,0603,,155 ℃,-55 ℃,RC0603J2-070RL,无铅,200 ppm/℃,1/10W,,0R; Part Name: 0603贴片电阻; ID: 1; SMD/DIP: SMD; Part Number: 101010103-0001
R58 R60 R62 = 101010103-0008: 1K,±5%,1/10W,0603,国巨,RC0603JR-071KL; Part Name: 0603贴片电阻; ID: 10; SMD/DIP: SMD; Part Number: 101010103-0008
R96 = 101010103-0002: 国巨,±5%,0603,,155 ℃,-55 ℃,RC0603JR-071ML,无铅,200 ppm/℃,1/10W,,1M; Part Name: 0603贴片电阻; ID: 11; SMD/DIP: SMD; Part Number: 101010103-0002
S1 S2 = 1011001-0027: TS-1102,机械轻触,6*6*4.3直插,6*6*4.3直插,乐清市羽欧电子; Part Name: 按键; ID: 32; SMD/DIP: DIP; Part Number: 1011001-0027
U1 = 101050101-0165: GD25VQ80CSIG,SOP8 208mil,北京兆易创新科技股份有限公司,GD25VQ80CSIG; Part Name: 贴片存储芯片FLASH; ID: 14; SMD/DIP: SMD; Part Number: 101050101-0165
U2 = 1010503-0013: S-1206B50-U3,S-1206B50-U3,SOT89-3,6.5 V,1.7 V,0.2 V,5 V,250mA@VIN≧VOUT(S)＋1.0 V﹐1.5 V≦VOUT(S),1 uA,精工电子; Part Name: 贴片稳压器; ID: 6; SMD/DIP: SMD; Part Number: 1010503-0013
U3 U6 = 1010503-0002: S-1206B33-U3T1G,S-1206B33-U3T1G,SOT89-3,6.5 V,1.7 V,0.15 V,3.3 V,250mA@VIN≧VOUT(S)＋1.0 V﹐1.5 V≦VOUT(S),1 uA,精工电子; Part Name: 线性稳压芯片; ID: 5; SMD/DIP: SMD; Part Number: 1010503-0002
U4 = 101040101-0003: Part Name: 红外接收头; ID: 39; SMD/DIP: DIP; Part Number: 101040101-0003
U8 = 101050101-0060: DRV8837DSGR,S-PWSON-N8,TI,DRV8837DSGR; Part Name: 驱动芯片; ID: 23; SMD/DIP: SMD; Part Number: 101050101-0060
U9 = AD_XN_ESAM_01: ESAM虚拟器件; Part Name: ESAM芯片; ID: 11; SMD/DIP: SMD; Part Number: AD_XN_ESAM_01
Y2 = 1010601-0009: SCX3215(SCX3213089);32.768kHz;精度20%;负载电容12.5pF,3215,32.768kHz,0.03 ppm/℃,无源,Q-SC32S03220C5AAAF,SCX3215; Part Name: 贴片晶振; ID: 20; SMD/DIP: SMD; Part Number: 1010601-0009